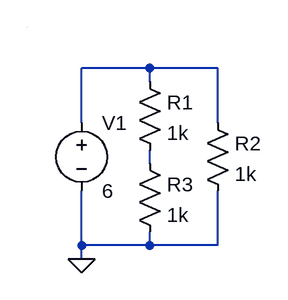
[diagram p0: schematic SeriesInParallel.asc]
SeriesInParallel.asc, the LTspice schematic file:
Version 4
SHEET 1 880 680
WIRE 144 48 64 48
WIRE 224 48 144 48
WIRE 144 64 144 48
WIRE 64 112 64 48
WIRE 224 112 224 48
WIRE 144 160 144 144
WIRE 64 256 64 192
WIRE 144 256 144 240
WIRE 144 256 64 256
WIRE 224 256 224 192
WIRE 224 256 144 256
WIRE 64 272 64 256
WIRE 0 0 0 0
FLAG 64 272 0
SYMBOL res 128 48 R0
SYMATTR InstName R1
SYMATTR Value 1k
SYMBOL res 208 96 R0
SYMATTR InstName R2
SYMATTR Value 1k
SYMBOL res 128 144 R0
SYMATTR InstName R3
SYMATTR Value 1k
SYMBOL voltage 64 96 R0
SYMATTR InstName V1
SYMATTR Value 6

The netlist it stands for:
* SeriesInParallel.asc
R1 N001 N002 1k
R2 N001 0 1k
R3 N002 0 1k
V1 N001 0 6
.backanno
.end